# EAGLE design JTAG20to10 (EAGLE 9.6.2)
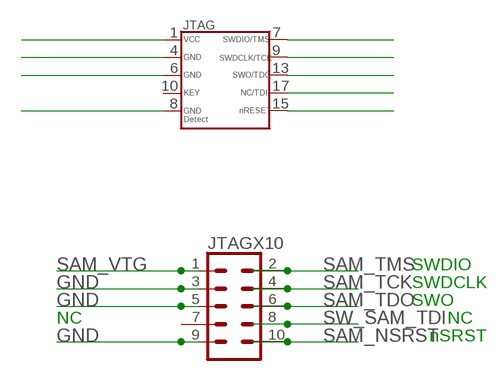
[diagram p0: schematic, sheet 1]

## Parts
JTAG  SWD/JTAGMOLEX20  [JTAG-ARM]
JTAGX10  CONN_05X2SHD-NS  [2X5-SHROUDED-NS]

## Nets
GND: JTAG.4 JTAG.6 JTAG.8 JTAGX10.3 JTAGX10.5 JTAGX10.9
SAM_NSRST: JTAG.15 JTAGX10.10
SAM_TCK: JTAG.9 JTAGX10.4
SAM_TDO: JTAG.13 JTAGX10.6
SAM_TMS: JTAG.7 JTAGX10.2
SAM_VTG: JTAG.1 JTAGX10.1
SW_SAM_TDI: JTAG.17 JTAGX10.8
Unconnected: JTAG.10 JTAGX10.7

## Notes on the sheet
- SWDIO
- SWDCLK
- SWO
- NC | NC
- nSRST

## Library data of the parts
JTAG = AtomBasics:SWD/JTAG: Serial Wire (SW-DP) Connector This standard 0.05" 10-pin connector is for use with the Cortex M0/M3's native SWD (serial wire debugger) interface (SW-DP). Some boards support a 20-pin combined JTAG+SWD connector (SWJ-DP), such as the LPC1700 family, but many smaller devices only work with SWD which typically use the smaller 10-pin SW-DP connecter (the LPC1300 family, for example, only supports SWD). 2x05 1.27mm/0.05" Connector: This is the standard SMT connector defined by ARM for all Cortex devices, and should be used in most situations and for forward-compatibility since any new devices coming to market will likely use this connector. MOLEX 10 Pin 0.1" Connector: This 0.1" 10 pin connector has the same pin layout as the standard 0.05" connector, but is easier to work with if you are using standard jumper wires or custom cables to connect your SWD hardware. MOLEX 20 Pin 0.1" Connector: This 0.1" 20 pin connector is the same model used for ARM7/ARM9 JTAG debuggers, but is connected to match the pins on the Segger J-Link for ARM (which supports both JTAG and SWD debugging). See the following document from ARM for more information on Cortex M3 Debug Connectors: http://infocenter.arm.com/help/topic/com.arm.doc.faqs/attached/13634/cortex_debug_connectors.pdf And the following page for an overview with images of the different connector types: http://www.keil.com/peripherals/coresight/connectors.asp
JTAGX10 = SparkFun-Connectors:CONN_05X2: Multi connection point. Often used as Generic Header-pin footprint for 0.1 inch spaced/style header connections For AVR SPI programming port, see special device with nice symbol: "AVR_SPI_PROG_5x2.dev" You can populate with any combo of single row headers, but if you'd like an exact match, check these: 2x5 AVR ICSP Male Header <https://www.sparkfun.com/products/778> (PRT-00778) 2x5 Pin Shrouded Header <https://www.sparkfun.com/products/8506> (PRT-08506) On any of the 0.1 inch spaced packages, you can populate with these: Break Away Headers - Straight <https://www.sparkfun.com/products/116> (PRT-00116) Break Away Male Headers - Right Angle <https://www.sparkfun.com/products/553> (PRT-00553) Female Headers <https://www.sparkfun.com/products/115> (PRT-00115) Break Away Headers - Machine Pin <https://www.sparkfun.com/products/117> (PRT-00117) Break Away Female Headers - Swiss Machine Pin <https://www.sparkfun.com/products/743> (PRT-00743) Special note: the shrouded connector mates well with our 5x2 ribbon cables: 2x5 Pin IDC Ribbon Cable <https://www.sparkfun.com/products/8535> (PRT-08535); PROD_ID: CONN-08671; SF_ID: PRT-08506

## Board
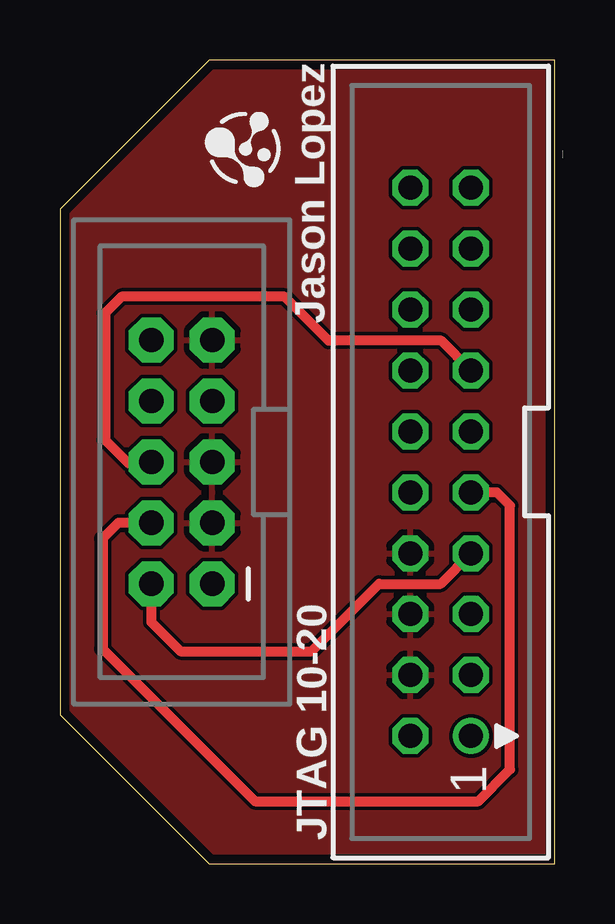
[diagram p1: board, top side]
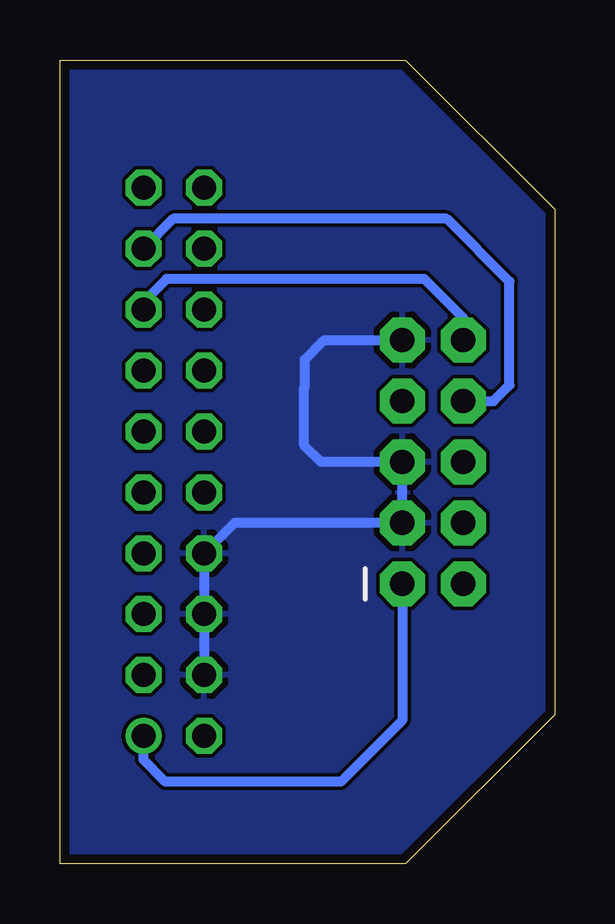
[diagram p2: board, bottom side, seen from below]

Size 20.62 x 33.52 mm. Coordinates in mm from the lower left corner, seen from the top.
Outline: 20.62,33.52 6.22,33.52 0,27.3 0,6.22 6.22,0 20.62,0 20.62,33.52
Copper layers (1*16): Top 0.035559375mm / dielectric 1.6mm / Bottom 0.035559375mm
Design rules "oshpark-2layer": minimum track width 6mil, minimum drill 10mil, track to track 6mil, track to pad 6mil, pad to pad 6mil, via to via 6mil, smd to smd 6mil, copper to edge 15mil, drill to drill 6mil, minimum pad ring 5mil, minimum via ring 5mil, stop-mask expansion 2.5mil, vias tented up to drill 0mil, thermal gap 10mil

### Footprints (pad centres in the part's own frame; a part is rotated, then mirrored left to right if it is on the bottom)
JTAG-ARM = drill 1: 1 -11.43,-1.27 | drill 1 octagon: 2 -11.43,1.27; 3 -8.89,-1.27; 4 -8.89,1.27; 5 -6.35,-1.27; 6 -6.35,1.27; 7 -3.81,-1.27; 8 -3.81,1.27; 9 -1.27,-1.27; 10 -1.27,1.27; 11 1.27,-1.27; 12 1.27,1.27; 13 3.81,-1.27; 14 3.81,1.27; 15 6.35,-1.27; 16 6.35,1.27; 17 8.89,-1.27; 18 8.89,1.27; 19 11.43,-1.27; 20 11.43,1.27
2X5-SHROUDED-NS = drill 1.016 pad 1.88 octagon: 1 -1.27,5.08; 2 1.27,5.08; 3 -1.27,2.54; 4 1.27,2.54; 5 -1.27,0; 6 1.27,0; 7 -1.27,-2.54; 8 1.27,-2.54; 9 -1.27,-5.08; 10 1.27,-5.08

### Placement (x,y rotation side)
JTAG  15.88,16.76 90 top
JTAGX10  5.08,16.76 180 top

### Tracks (layer width: path | path; a pad name or v marks a point on that pad's centre or on a via)
GND
  Bottom 0.406: JTAGX10.9 9.61,21.84 10.41,21.03 10.41,19.89 10.44,19.86 10.44,17.45 9.75,16.76 JTAGX10.5 JTAGX10.3 13.34,14.22 JTAG.8 JTAG.6 JTAG.4
  pour Top: 0,0.05 0,34.14 20.7,34.14 20.7,0.03 0,0.03
  pour Bottom: 20.68,0 20.68,34.09 -0.03,34.09 -0.03,-0.03 20.68,-0.03
SAM_NSRST
  Bottom 0.406: JTAGX10.10 3.81,22.76 5.44,24.38 16.18,24.38 17.14,23.42 JTAG.15
SAM_TCK
  Top 0.406: JTAGX10.4 2.43,14.22 1.78,13.56 1.78,8.97 8.13,2.62 17.45,2.62 18.77,3.94 18.77,14.94 18.21,15.49 JTAG.9
SAM_TDO
  Top 0.406: JTAG.13 15.9,21.82 11.2,21.82 9.37,23.65 2.56,23.65 1.88,22.96 1.88,17.68 2.85,16.71 3.76,16.71 JTAGX10.6
SAM_TMS
  Top 0.406: JTAGX10.2 3.81,10.08 5.03,8.87 10.49,8.87 13.31,11.68 15.88,11.68 JTAG.7
SAM_VTG
  Bottom 0.406: JTAGX10.1 6.35,5.99 8.91,3.43 16.23,3.43 17.14,4.34 JTAG.1
SW_SAM_TDI
  Bottom 0.406: JTAGX10.8 2.54,19.3 1.88,19.96 1.88,24.28 4.5,26.9 15.9,26.9 JTAG.17

### Text on the board
tPlace: Jason Lopez | JTAG 10-20